# Altium schematic sheet mcu.SchDoc: MCU
size B; Engineer: Jacob Faucett; Organization: CUAir; Address1: L3, 12a Rodborough Rd; Address2: Frenchs Forest; Address3: NSW; Address4: Australia 2086; Revision: 1; SheetNumber: 2; SheetTotal: 9; CompetitionYear: 2025; CPN: N/A; PROJECT: Current Logging and Validation Board
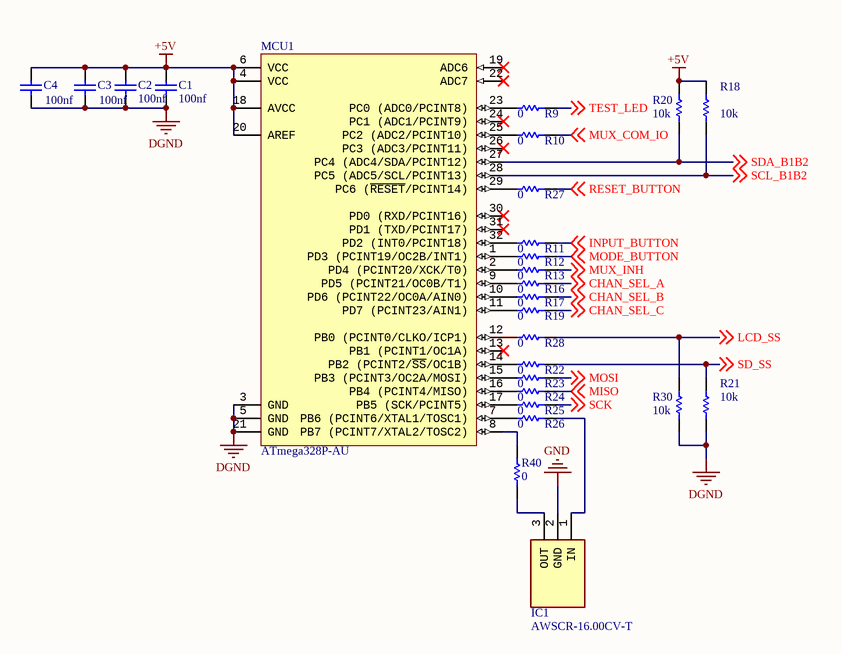
[diagram p0: mcu.SchDoc]

## Parts
C1  100nf  [CAPC2013X95X45ML10T25]
C2  100nf  [CAPC2013X95X45NL10T25]
C3  100nf  [CAPC2013X95X45NL10T25]
C4  100nf  [CAPC2013X95X45NL10T25]
IC1  AWSCR-16.00CV-T  [AWSCR1600CVT]
MCU1  ATmega328P-AU  [32A_M]
R9  value 0  [0805]  (hidden comment: 0 (Empty Jumper))
R10  value 0  [0805]  (hidden comment: 0 (Empty Jumper))
R11  value 0  [0805]  (hidden comment: 0 (Empty Jumper))
R12  value 0  [0805]  (hidden comment: 0 (Empty Jumper))
R13  value 0  [0805]  (hidden comment: 0 (Empty Jumper))
R16  value 0  [0805]  (hidden comment: 0 (Empty Jumper))
R17  value 0  [0805]  (hidden comment: 0 (Empty Jumper))
R18  value 10k  [0805]  (hidden comment: 10000 (10k))
R19  value 0  [0805]  (hidden comment: 0 (Empty Jumper))
R20  value 10k  [0805]  (hidden comment: 10000 (10k))
R21  value 10k  [0805]  (hidden comment: 10000 (10k))
R22  value 0  [0805]  (hidden comment: 0 (Empty Jumper))
R23  value 0  [0805]  (hidden comment: 0 (Empty Jumper))
R24  value 0  [0805]  (hidden comment: 0 (Empty Jumper))
R25  value 0  [0805]  (hidden comment: 0 (Empty Jumper))
R26  value 0  [0805]  (hidden comment: 0 (Empty Jumper))
R27  value 0  [0805]  (hidden comment: 0 (Empty Jumper))
R28  value 0  [0805]  (hidden comment: 0 (Empty Jumper))
R30  value 10k  [0805]  (hidden comment: 10000 (10k))
R40  value 0  [0805]  (hidden comment: 0 (Empty Jumper))

## Nets
+5V: C1.2 C2.2 C3.2 C4.2 MCU1.4(VCC) MCU1.6(VCC) MCU1.18(AVCC) MCU1.20(AREF) R18.2 R20.2
DGND: C1.1 C2.1 C3.1 C4.1 MCU1.3(GND) MCU1.5(GND) MCU1.21(GND) R21.1 R30.1
GND: IC1.2(GND)
CHAN_SEL_A: R16.2 ; off-sheet CHAN_SEL_A
CHAN_SEL_B: R17.2 ; off-sheet CHAN_SEL_B
CHAN_SEL_C: R19.2 ; off-sheet CHAN_SEL_C
INPUT_BUTTON: R11.2 ; off-sheet INPUT_BUTTON
LCD_SS: R28.2 R30.2 ; off-sheet LCD_SS
MISO: R24.2 ; off-sheet MISO
MODE_BUTTON: R12.2 ; off-sheet MODE_BUTTON
MOSI: R23.2 ; off-sheet MOSI
MUX_COM_IO: R10.2 ; off-sheet MUX_COM_IO
MUX_INH: R13.2 ; off-sheet MUX_INH
RESET_BUTTON: R27.2 ; off-sheet RESET_BUTTON
SCK: R25.2 ; off-sheet SCK
SCL_B1B2: MCU1.28(PC5_(ADC5/SCL/PCINT13)) R18.1 ; off-sheet SCL_B1B2
SD_SS: R21.2 R22.2 ; off-sheet SD_SS
SDA_B1B2: MCU1.27(PC4_(ADC4/SDA/PCINT12)) R20.1 ; off-sheet SDA_B1B2
TEST_LED: R9.2 ; off-sheet TEST_LED
NetIC1_1: IC1.1(IN) R26.2
NetIC1_3: IC1.3(OUT) R40.1
NetMCU1_1: MCU1.1(PD3_(PCINT19/OC2B/INT1)) R12.1
NetMCU1_2: MCU1.2(PD4_(PCINT20/XCK/T0)) R13.1
NetMCU1_7: MCU1.7(PB6_(PCINT6/XTAL1/TOSC1)) R26.1
NetMCU1_8: MCU1.8(PB7_(PCINT7/XTAL2/TOSC2)) R40.2
NetMCU1_9: MCU1.9(PD5_(PCINT21/OC0B/T1)) R16.1
NetMCU1_10: MCU1.10(PD6_(PCINT22/OC0A/AIN0)) R17.1
NetMCU1_11: MCU1.11(PD7_(PCINT23/AIN1)) R19.1
NetMCU1_12: MCU1.12(PB0_(PCINT0/CLKO/ICP1)) R28.1
NetMCU1_14: MCU1.14(PB2_(PCINT2/~{SS}/OC1B)) R22.1
NetMCU1_15: MCU1.15(PB3_(PCINT3/OC2A/MOSI)) R23.1
NetMCU1_16: MCU1.16(PB4_(PCINT4/MISO)) R24.1
NetMCU1_17: MCU1.17(PB5_(SCK/PCINT5)) R25.1
NetMCU1_23: MCU1.23(PC0_(ADC0/PCINT8)) R9.1
NetMCU1_25: MCU1.25(PC2_(ADC2/PCINT10)) R10.1
NetMCU1_29: MCU1.29(PC6_(~{RESET}/PCINT14)) R27.1
NetMCU1_32: MCU1.32(PD2_(INT0/PCINT18)) R11.1

Not connected (* = marked no-connect by the designer): MCU1 13(PB1_(PCINT1/OC1A))* 19(ADC6)* 22(ADC7)* 24(PC1_(ADC1/PCINT9))* 26(PC3_(ADC3/PCINT11))* 30(PD0_(RXD/PCINT16))* 31(PD1_(TXD/PCINT17))*

## Notes on the sheet
- Project
- Title
- Size:
- Date:
- B
- Number:
- Revision:
- File:

## Library data of the parts
C1-C4 = CMP-1036-04169-2: Manufacturer: Murata; Part Number: GRM219R71H333KA01D
IC1 = CMP-031-00009-1: Industrial Grade Ceramic Resonator 16MHz; Manufacturer_Name: ABRACON; Arrow Price/Stock: https://www.arrow.com/en/products/awscr-16.00cv-t/abracon?region=nac; Manufacturer_Part_Number: AWSCR-16.00CV-T; Height: 1mm; Design Item ID: AWSCR-16.00CV-T; MPN: AWSCR-16.00CV-T; Source: SamacSys.SchLib; Arrow Part Number: AWSCR-16.00CV-T; Datasheet Link: https://abracon.com/Resonators/AWSCR_CV.pdf
MCU1 = CMP-0095-00269-2: 8-bit AVR Microcontroller, 32KB Flash, 1KB EEPROM, 2KB SRAM, 32-pin TQFP, Industrial Grade (-40°C to 85°C); PackageDescription: 32-Lead, 7x7x1.0 mm Body, 0.8mm Lead Pitch, Thin Profile Plastic Quad Flat Package (TQFP); DatasheetVersion: revD, May-2011; RevisionNote: DatasheetVersion & PackageVersion updated. URLs added.; ComponentLink1URL: http://www.atmel.com/; ComponentLink2Description: ATmega48A/48PA/88A/88PA/168A/168PA/328/328P Datasheet; Code_JEDEC: MS-026-ABA; ComponentLink1Description: Manufacturer URL; PackageReference: 32A; ComponentLink3Description: ATmega48A/48PA/88A/88PA/168A/168PA/328/328P Summary; ComponentLink2URL: http://www.atmel.com/dyn/resources/prod_documents/doc8271.pdf; PackageVersion: revC, Oct-2010; ComponentLink3URL: http://www.atmel.com/dyn/resources/prod_documents/8271S.pdf
R9-R13 R16 R17 R19 R22-R28 R40 = CMP-009-00239-1: RES Thick Film, 0Ω, 0.125W, 150V, 0805; Design Item ID: 0 (Empty Jumper); DNI: DNI; Source: JLCPCB Resistor Schematic Lib.SchLib; ComponentLink1Description: Source; DNP: DNP; ComponentLink1URL: https://www.mouser.com/ProductDetail/Panasonic/ERJ-6GEY0R00V?qs=tQNqqtTOejLLHbaWAzeH1w%3D%3D
R18 R20 R21 R30 = CMP-009-00203-1: RES Thick Film, 10kΩ, 0.125W, 150V, 0805; Manufacturer: UNI-ROYAL; MPN: 0805W8F1002T5E; Power Rating: 125mW; ComponentLink1URL: https://jlcpcb.com/partdetail/18102-0805W8F1002T5E/C17414; ComponentLink1Description: Source; Design Item ID: 10000 (10k); JLCPCB Basic Part: TRUE; Voltage Rating: 150V; Source: JLCPCB Resistor Schematic Lib.SchLib; JLCPCB Part #: C17414